# Altium project GD_Tcontroller.PrjPcb
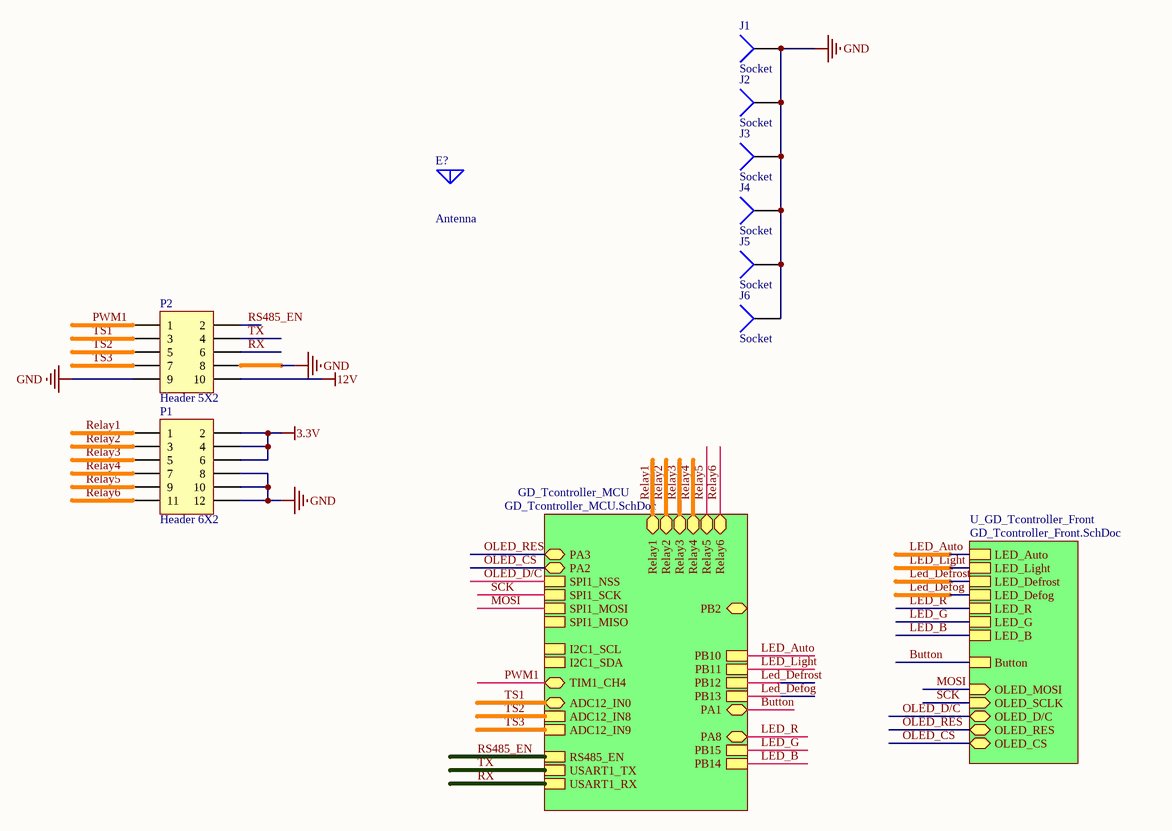
[diagram p0: GD_Tcontroller.SchDoc]
3 sheets, 61 parts. Net scope: hierarchical (ports join the sheet entries above them; power ports are global).
Board file: GD_Tcontroller.PcbDoc
Sheets:
  GD_Tcontroller.SchDoc
    GD_Tcontroller_MCU = GD_Tcontroller_MCU.SchDoc
    U_GD_Tcontroller_Front = GD_Tcontroller_Front.SchDoc

## Sheet GD_Tcontroller.SchDoc
size A4

### Parts
E?  Antenna  [OLED]
J1  Socket  [SCREWFG3_2]
J2  Socket  [SCREWFG3_2]
J3  Socket  [SCREWFG3_2]
J4  Socket  [SCREWFG3_2]
J5  Socket  [SCREWFG3_2]
J6  Socket  [SCREWFG3_2]
P1  Header 6X2  [DC3-12P]
P2  Header 5X2  [DC3-10P]

### Sub-sheets
GD_Tcontroller_MCU = GD_Tcontroller_MCU.SchDoc: USART1_TX, USART1_RX, SPI1_SCK, SPI1_MISO, SPI1_MOSI, SPI1_NSS, I2C1_SCL, I2C1_SDA, ADC12_IN8, ADC12_IN9, RS485_EN, PB10, PB11, PB12, PB13, PB14, PB15, PA2, PA3, PB2, Relay1, Relay5, Relay4, Relay3, Relay6, Relay2, TIM1_CH4, PA1, ADC12_IN0, PA8
U_GD_Tcontroller_Front = GD_Tcontroller_Front.SchDoc: LED_B, LED_G, LED_R, Button, LED_Auto, LED_Light, LED_Defrost, LED_Defog, OLED_MOSI (in), OLED_SCLK (in), OLED_D/C (bidir), OLED_RES (bidir), OLED_CS (bidir)

### Nets
3.3V: P1.2 P1.4 P1.6
12V: P2.10
GND: J1.1 J2.1 J3.1 J4.1 J5.1 J6.1 P1.8 P1.10 P1.12 P2.8 P2.9
Button: sheet GD_Tcontroller_MCU/PA1, sheet U_GD_Tcontroller_Front/Button
LED_Auto: sheet GD_Tcontroller_MCU/PB10, sheet U_GD_Tcontroller_Front/LED_Auto
LED_B: sheet GD_Tcontroller_MCU/PB14, sheet U_GD_Tcontroller_Front/LED_B
Led_Defog: sheet GD_Tcontroller_MCU/PB13, sheet U_GD_Tcontroller_Front/LED_Defog
Led_Defrost: sheet GD_Tcontroller_MCU/PB12, sheet U_GD_Tcontroller_Front/LED_Defrost
LED_G: sheet GD_Tcontroller_MCU/PB15, sheet U_GD_Tcontroller_Front/LED_G
LED_Light: sheet GD_Tcontroller_MCU/PB11, sheet U_GD_Tcontroller_Front/LED_Light
LED_R: sheet GD_Tcontroller_MCU/PA8, sheet U_GD_Tcontroller_Front/LED_R
MOSI: sheet GD_Tcontroller_MCU/SPI1_MOSI, sheet U_GD_Tcontroller_Front/OLED_MOSI
OLED_CS: sheet GD_Tcontroller_MCU/PA2, sheet U_GD_Tcontroller_Front/OLED_CS
OLED_D/C: sheet GD_Tcontroller_MCU/SPI1_NSS, sheet U_GD_Tcontroller_Front/OLED_D/C
OLED_RES: sheet GD_Tcontroller_MCU/PA3, sheet U_GD_Tcontroller_Front/OLED_RES
PWM1: P2.1 ; sheet GD_Tcontroller_MCU/TIM1_CH4
Relay1: P1.1 ; sheet GD_Tcontroller_MCU/Relay1
Relay2: P1.3 ; sheet GD_Tcontroller_MCU/Relay2
Relay3: P1.5 ; sheet GD_Tcontroller_MCU/Relay3
Relay4: P1.7 ; sheet GD_Tcontroller_MCU/Relay4
Relay5: P1.9 ; sheet GD_Tcontroller_MCU/Relay5
Relay6: P1.11 ; sheet GD_Tcontroller_MCU/Relay6
RS485_EN: P2.2 ; sheet GD_Tcontroller_MCU/RS485_EN
RX: P2.6 ; sheet GD_Tcontroller_MCU/USART1_RX
SCK: sheet GD_Tcontroller_MCU/SPI1_SCK, sheet U_GD_Tcontroller_Front/OLED_SCLK
TS1: P2.3 ; sheet GD_Tcontroller_MCU/ADC12_IN0
TS2: P2.5 ; sheet GD_Tcontroller_MCU/ADC12_IN8
TS3: P2.7 ; sheet GD_Tcontroller_MCU/ADC12_IN9
TX: P2.4 ; sheet GD_Tcontroller_MCU/USART1_TX

### Library data of the parts
E? = Antenna: Generic Antenna; Published: 24-Mar-1999; LatestRevisionDate: 17-Jul-2002; LatestRevisionNote: Re-released for DXP Platform.; PackageReference: PIN1; Publisher: Altium Limited
P1 = Header 6X2: Header, 6-Pin, Dual row; LatestRevisionDate: 17-Jul-2002; LatestRevisionNote: Re-released for DXP Platform.; Publisher: Altium Limited
P2 = Header 5X2: Header, 5-Pin, Dual row; LatestRevisionDate: 17-Jul-2002; LatestRevisionNote: Re-released for DXP Platform.; Publisher: Altium Limited
J1-J6 = Socket: LatestRevisionDate: 17-Jul-2002; LatestRevisionNote: Re-released for DXP Platform.; Publisher: Altium Limited

## Sheet GD_Tcontroller_MCU.SchDoc
size A4
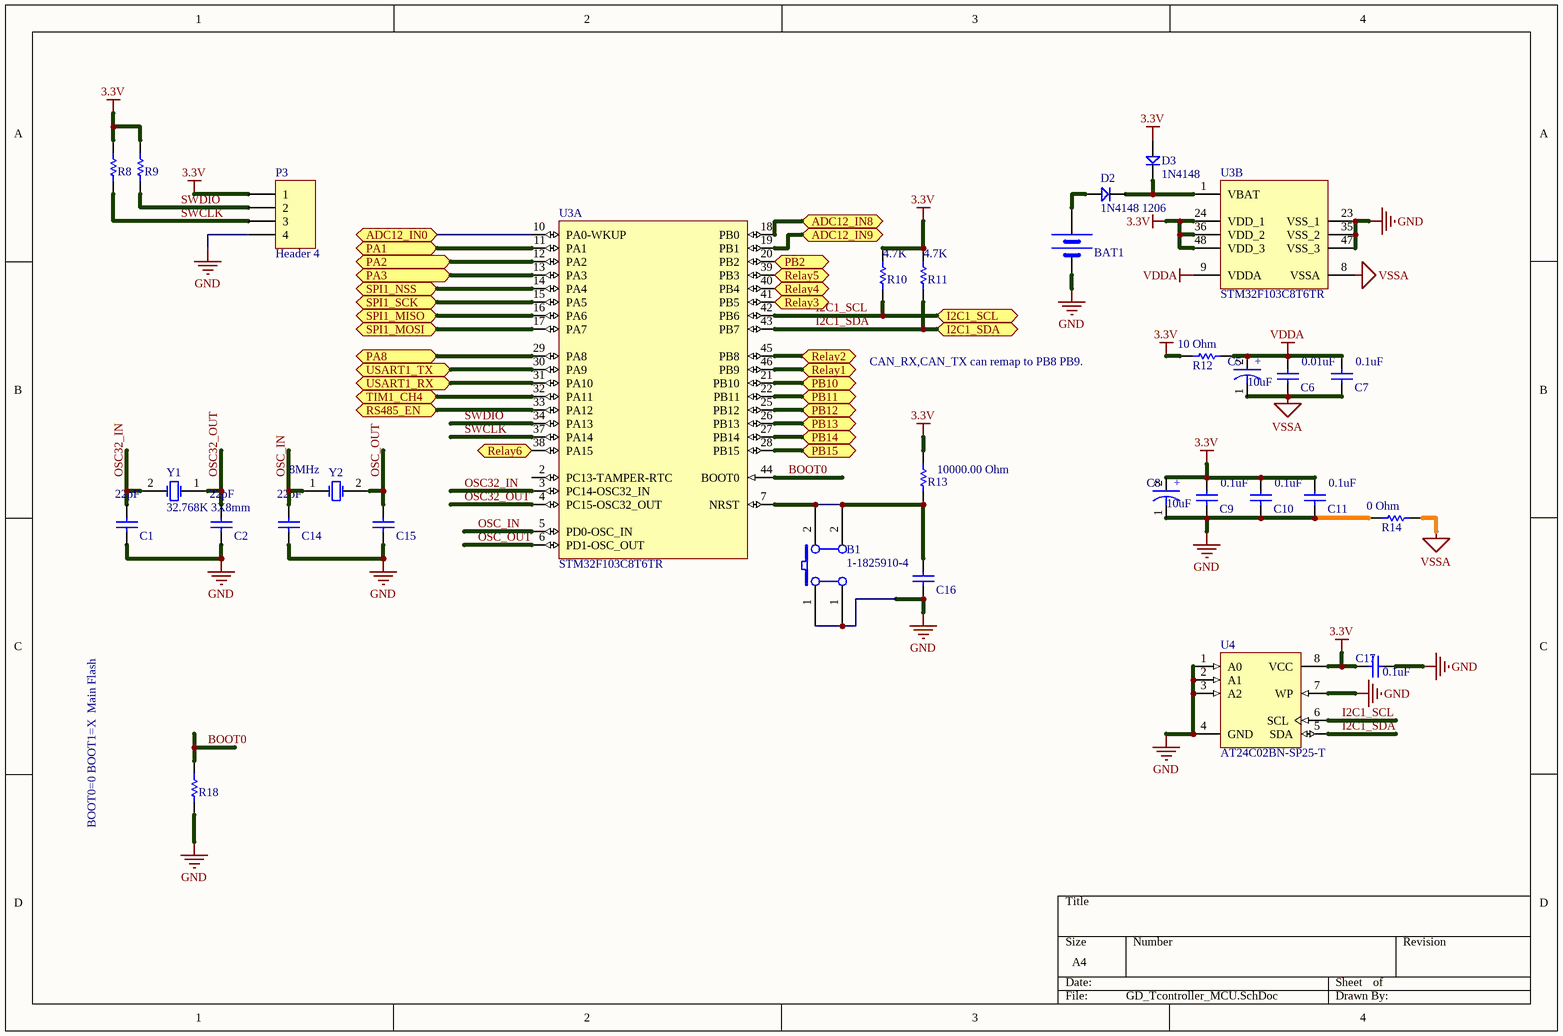
[diagram p1: GD_Tcontroller_MCU.SchDoc]

### Parts
B1  value 1-1825910-4  [AN6_3P6_5]  (hidden comment: SW PUSHBUTTON)
BAT1  CR1220 Sockect SMD  [BATM]  (value not drawn)
C1  value 22pF  [C0805]  (hidden comment: CAP 22pF 50V 0805(2012))
C2  value 22pF  [C0805]  (hidden comment: CAP 22pF 50V 0805(2012))
C5  value 10uF  [TAN3216]  (hidden comment: CAPACITOR)
C6  value 0.01uF  [C0805]  (hidden comment: CAP 0.01uF 50V 0805(2012))
C7  value 0.1uF  [C0805]  (hidden comment: CAP 0.1uF 50V 0805(2012))
C8  value 10uF  [TAN3216]  (hidden comment: CAPACITOR)
C9  value 0.1uF  [C0805]  (hidden comment: CAP 0.1uF 50V 0805(2012))
C10  value 0.1uF  [C0805]  (hidden comment: CAP 0.1uF 50V 0805(2012))
C11  value 0.1uF  [C0805]  (hidden comment: CAP 0.1uF 50V 0805(2012))
C14  value 22pF  [C0805]  (hidden comment: CAP 22pF 50V 0805(2012))
C15  CAP 22pF 50V 0805(2012)  [C0805]  (value not drawn)
C16  CAP 0.1uF 50V 0805(2012)  [C0805]  (value not drawn)
C17  value 0.1uF  [C0805]  (hidden comment: CAP 0.1uF 50V 0805(2012))
D2  1N4148 1206  [DIODE_SOP]
D3  1N4148  [DIODE_SOP]
P3  Header 4  [HDR1X4]
R8  10K 5% 0805(2012)  [R0805]  (value not drawn)
R9  10K 5% 0805(2012)  [R0805]  (value not drawn)
R10  value 4.7K  [R0805]  (hidden comment: 4.7K 5% 0805(2012))
R11  value 4.7K  [R0805]  (hidden comment: 4.7K 5% 0805(2012))
R12  value 10 Ohm  [R0805]  (hidden comment: 10Ohm 5% 0805(2012))
R13  value 10000.00 Ohm  [R0805]  (hidden comment: 10K 5% 0805(2012))
R14  value 0 Ohm  [R0805]  (hidden comment: 0 Ohm 5% 0805(2012))
R18  10K 5% 0805(2012)  [R0805]  (value not drawn)
U3  STM32F103C8T6TR  [STM-LQFP48_L]  (parts A,B of 2)
U4  AT24C02BN-SP25-T  [8S1_L]
Y1  32.768K 3X8mm  [XTAL32]
Y2  8MHz  [XTAL_US]

### Ports
ADC12_IN0, ADC12_IN8, ADC12_IN9, I2C1_SCL, I2C1_SDA, PA1, PA2, PA3, PA8, PB2, PB10, PB11, PB12, PB13, PB14, PB15, Relay1, Relay2, Relay3, Relay4, Relay5, Relay6, RS485_EN, SPI1_MISO, SPI1_MOSI, SPI1_NSS, SPI1_SCK, TIM1_CH4, USART1_RX, USART1_TX

### Nets
3.3V: C8.2 C9.2 C10.2 C11.2 C17.2 D3.1 P3.1 R8.1 R9.1 R10.1 R11.1 R12.1 R13.1 U3.24(VDD_1) U3.36(VDD_2) U3.48(VDD_3) U4.8(VCC)
GND: B1.1(A0) BAT1.2(GND) C1.1 C2.1 C8.1 C9.1 C10.1 C11.1 C14.1 C15.1 C16.1 C17.1 P3.4 R14.1 R18.2 U3.23(VSS_1) U3.35(VSS_2) U3.47(VSS_3) U4.1(A0) U4.2(A1) U4.3(A2) U4.4(GND) U4.7(WP)
VDDA: C5.2 C6.2 C7.2 R12.2 U3.9(VDDA)
VSSA: C5.1 C6.1 C7.1 R14.2 U3.8(VSSA)
BOOT0: R18.1 U3.44(BOOT0)
Button: U3.11(PA1) ; port PA1
I2C1_SCL: R10.2 U3.42(PB6) U4.6(SCL) ; port I2C1_SCL
I2C1_SDA: R11.2 U3.43(PB7) U4.5(SDA) ; port I2C1_SDA
LED_Auto: U3.21(PB10) ; port PB10
LED_B: U3.27(PB14) ; port PB14
Led_Defog: U3.26(PB13) ; port PB13
Led_Defrost: U3.25(PB12) ; port PB12
LED_G: U3.28(PB15) ; port PB15
LED_Light: U3.22(PB11) ; port PB11
LED_R: U3.29(PA8) ; port PA8
MOSI: U3.17(PA7) ; port SPI1_MOSI
OLED_CS: U3.12(PA2) ; port PA2
OLED_D/C: U3.14(PA4) ; port SPI1_NSS
OLED_RES: U3.13(PA3) ; port PA3
OSC32_IN: C1.2 U3.3(PC14-OSC32_IN) Y1.2(OSC2)
OSC32_OUT: C2.2 U3.4(PC15-OSC32_OUT) Y1.1(OSC1)
OSC_IN: C14.2 U3.5(PD0-OSC_IN) Y2.1(OSC1)
OSC_OUT: C15.2 U3.6(PD1-OSC_OUT) Y2.2(OSC2)
PWM1: U3.32(PA11) ; port TIM1_CH4
Relay1: U3.46(PB9) ; port Relay1
Relay2: U3.45(PB8) ; port Relay2
Relay3: U3.41(PB5) ; port Relay3
Relay4: U3.40(PB4) ; port Relay4
Relay5: U3.39(PB3) ; port Relay5
Relay6: U3.38(PA15) ; port Relay6
RS485_EN: U3.33(PA12) ; port RS485_EN
RX: U3.31(PA10) ; port USART1_RX
SCK: U3.15(PA5) ; port SPI1_SCK
SWCLK: P3.3 R8.2 U3.37(PA14)
SWDIO: P3.2 R9.2 U3.34(PA13)
TS1: U3.10(PA0-WKUP) ; port ADC12_IN0
TS2: U3.18(PB0) ; port ADC12_IN8
TS3: U3.19(PB1) ; port ADC12_IN9
TX: U3.30(PA9) ; port USART1_TX
NetB1_2: B1.2(B0) C16.2 R13.2 U3.7(NRST)
NetBAT1_1: BAT1.1(VCC) D2.1
NetD2_2: D2.2 D3.2 U3.1(VBAT)
NetU3_16: U3.16(PA6) ; port SPI1_MISO
NetU3_20: U3.20(PB2) ; port PB2

Not connected (* = marked no-connect by the designer): U3 2(PC13-TAMPER-RTC)

### Notes on the sheet
- CAN_RX,CAN_TX can remap to PB8 PB9.
- BOOT0=0 BOOT1=X  Main Flash
- (in symbol EC00035) +

### Library data of the parts
B1 = ES00003: Button ON/OFF，6.3X6.3X9.5MM,DIP-2; Manufacturer: Tyco Electronics; ID: 3; HelpURL: \\192.168.1.3\Esh\Department\RD\CAD\Component\button\ENG_CD_1825910_C6[1].pdf; P/N: ES00003; Manufacturer P/N: 1-1825910-4; Type: *****
BAT1 = BAT
C1 C2 C14 C15 = CMP-1036-01234-1: CAP 22pF 50V ±1% 0805 (2012 Metric) Thickness 0.75mm SMD; Case-EIA: 0805; Case-Metric: 2012; Rated Voltage: 50 V; Tolerance: ±1%; Technology: SMT; Max Thickness: 0.75 mm
  C15: Value: 22pF
C5 C8 = EC00035: TAN 10uF 20% 10V 3216; Manufacturer: AVX; Manufacturer P/N: TAJE106K050RNJ; ID: 35; Type: ****; HelpURL: \\192.168.1.3\Esh\Department\RD\CAD\Component\Capacitor\smd\AVX_tps.PDF; P/N: EC00035
C6 C7 C9-C11 C16 C17 = CMP-1036-00070-1: CAP 0.1uF 50V ±20% 0805 (2012 Metric) Thickness 1mm SMD; Case-Metric: 2012; Case-EIA: 0805; Tolerance: 20%; Rated Voltage: 50 V; Technology: SMT; Max Thickness: 1 mm
  C16: Value: 0.1uF
D2 = D: 1N4148
D3 = D
P3 = Header 4: Header, 4-Pin; LatestRevisionDate: 17-Jul-2002; LatestRevisionNote: Re-released for DXP Platform.; Publisher: Altium Limited
R8 R9 R18 = CMP-1013-00098-1: 10K 0.125W 5% 0805 (2012 Metric)  SMD; Case-EIA: 0805; Case-Metric: 2012; Value: 10000.00 Ohm; Power: 0.125 W; Technology: SMT; Tolerance: 5 %
R10 R11 = CMP-1013-00098-1: 4.7K 0.125W 5% 0805 (2012 Metric)  SMD; Case-EIA: 0805; Case-Metric: 2012; Power: 0.125 W; Technology: SMT; Tolerance: 5 %
R12 R14 = CMP-1013-00098-1: 10Ohm 0.125W 5% 0805 (2012 Metric)  SMD; Case-EIA: 0805; Case-Metric: 2012; Power: 0.125 W; Technology: SMT; Tolerance: 5 %
R13 = CMP-1013-00098-1: 10K 0.125W 5% 0805 (2012 Metric)  SMD; Case-EIA: 0805; Case-Metric: 2012; Power: 0.125 W; Technology: SMT; Tolerance: 5 %
U3 = CMP-0237-00216-3: ARM Cortex-M3 32-bit MCU, 64 KB Flash, 20 KB Internal RAM, 37 I/Os, 48-pin LQFP, -40 to 85 degC, Tape and Reel; A/D Converter: 2x12-bit (10 Channel); Internal RAM Size (kB): 20; Supply Voltage(Vcc) min (V): 2; I/Os (High Current): 37; FLASH Size (Prog) (kB): 64; Operating Frequency(F) (Processor speed) (MHz): 72; Packing: Tape and Reel; PackageReference: LQFP48; ComponentLink2Description: Datasheet; Core: ARM Cortex-M3; ComponentLink3URL: http://www.st.com/st-web-ui/static/active/en/resource/technical/document/datasheet/DM00058181.pdf; ComponentLink1Description: Manufacturer URL; ComponentLink3Description: Package Specification; PartNumber: STM32F103C8T6TR; PackageVersion: Rev. 6, 06/2013; ComponentLink2URL: http://www.st.com/st-web-ui/static/active/en/resource/technical/document/datasheet/CD00161566.pdf; PackageDescription: 48-Pin Low Profile Quad Flat Package, 7 x 7 mm Body, 0.5 mm Pitch; Mounting Technology: Surface Mount; DatasheetVersion: Rev. 16; ComponentLink1URL: http://www.st.com/web/en/home.html
U4 = CMP-0152-00023-1: 2Kbit (256 x 8), 2-wire Bus Automotive Serial EEPROM with full memory Write Protect, 2.5V, 8-Pin SOIC, Tape & Reel; PackageDescription: 8-Lead (0.150" Wide Body), Plastic Gull Wing Small Outline (JEDEC SOIC); Code_IPC: SOIC127P600-8; PackageReference: 8S1; DatasheetVersion: 8517C,  Jan-2009; Code_JEDEC: MS-012-AA; PackageVersion: revC, Mar-2005
Y1 = XTAL_1: 32.768K 3mmX8mm; Published: 8-Jun-2000; LatestRevisionDate: 17-Jul-2002; LatestRevisionNote: Re-released for DXP Platform.; Publisher: Altium Limited
Y2 = XTAL: Crystal Oscillator; Published: 8-Jun-2000; LatestRevisionDate: 17-Jul-2002; LatestRevisionNote: Re-released for DXP Platform.; Publisher: Altium Limited

## Sheet GD_Tcontroller_Front.SchDoc
size A4
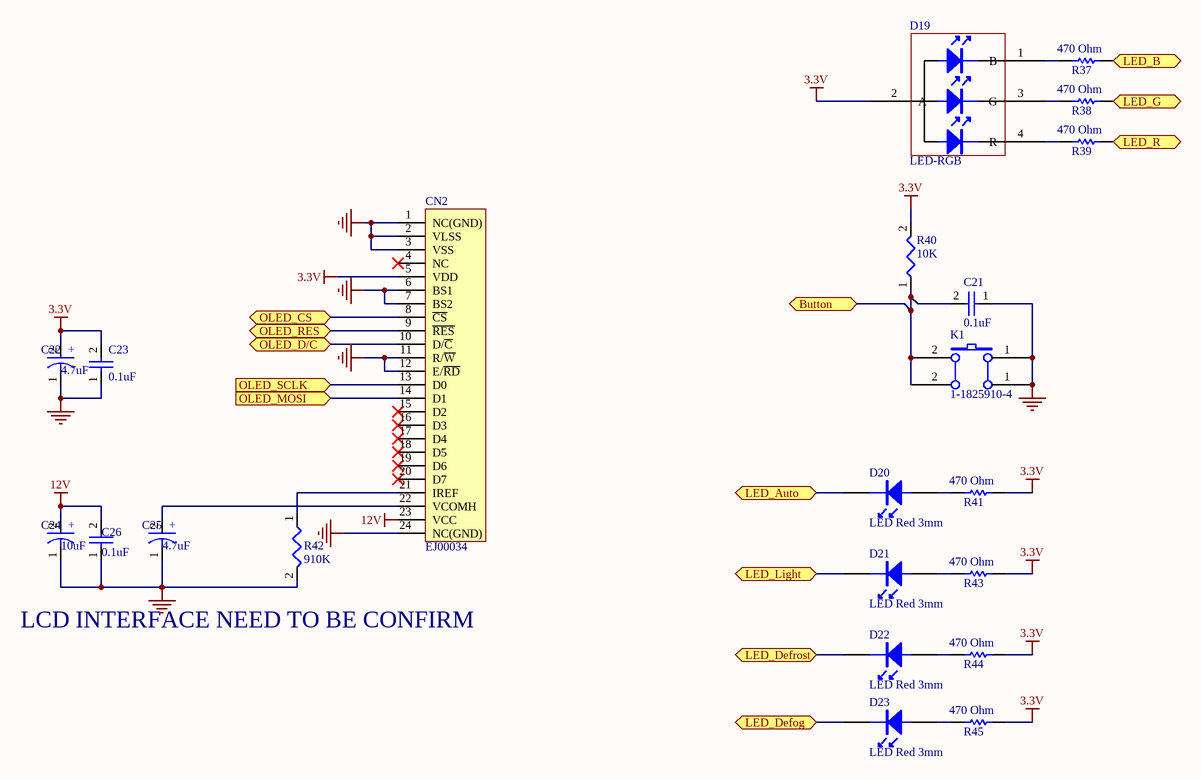
[diagram p2: GD_Tcontroller_Front.SchDoc]

### Parts
C21  value 0.1uF  [C0805]  (hidden comment: CAP)
C22  value 4.7uF  [TAN3216]  (hidden comment: CAPACITOR)
C23  value 0.1uF  [C0805]  (hidden comment: CAP)
C24  value 10uF  [TAN6032]  (hidden comment: CAPACITOR)
C25  value 4.7uF  [TAN6032]  (hidden comment: CAPACITOR)
C26  value 0.1uF  [C0805]  (hidden comment: CAP)
CN2  EJ00034  [FPC24P0_5]
D19  LED-RGB  [LED-RGB-3528]
D20  LED Red 3mm  [LED_DIP]
D21  LED Red 3mm  [LED_DIP]
D22  LED Red 3mm  [LED_DIP]
D23  LED Red 3mm  [LED_DIP]
K1  value 1-1825910-4  [AN6_3P6_5]  (hidden comment: SW PUSHBUTTON)
R37  value 470 Ohm  [R0805]  (hidden comment: 470 Ohm 5% 0805)
R38  value 470 Ohm  [R0805]  (hidden comment: 470 Ohm 5% 0805)
R39  value 470 Ohm  [R0805]  (hidden comment: 470 Ohm 5% 0805)
R40  value 10K  [R0805]  (hidden comment: RES)
R41  value 470 Ohm  [R0805]  (hidden comment: 470 Ohm 5% 0805)
R42  value 910K  [R0805]  (hidden comment: RES)
R43  value 470 Ohm  [R0805]  (hidden comment: 470 Ohm 5% 0805)
R44  value 470 Ohm  [R0805]  (hidden comment: 470 Ohm 5% 0805)
R45  value 470 Ohm  [R0805]  (hidden comment: 470 Ohm 5% 0805)

### Ports
Button, LED_Auto, LED_B, LED_Defog, LED_Defrost, LED_G, LED_Light, LED_R, OLED_CS (bidir), OLED_D/C (bidir), OLED_MOSI (in), OLED_RES (bidir), OLED_SCLK (in)

### Nets
3.3V: C22.2 C23.2 CN2.5(VDD) D19.2(A) R40.2 R41.2 R43.2 R44.2 R45.2
12V: C24.2 C26.2 CN2.23(VCC)
GND: C21.1 C22.1 C23.1 C24.1 C25.1 C26.1 CN2.1(NC(GND)) CN2.2(VLSS) CN2.3(VSS) CN2.6(BS1) CN2.7(BS2) CN2.11(R/~{W}) CN2.12(E/~{RD}) CN2.24(NC(GND)) K1.1(A0) R42.2
Button: C21.2 K1.2(B0) R40.1 ; port Button
LED_Auto: D20.2 ; port LED_Auto
LED_B: R37.2 ; port LED_B
Led_Defog: D23.2 ; port LED_Defog
Led_Defrost: D22.2 ; port LED_Defrost
LED_G: R38.2 ; port LED_G
LED_Light: D21.2 ; port LED_Light
LED_R: R39.2 ; port LED_R
MOSI: CN2.14(D1) ; port OLED_MOSI
OLED_CS: CN2.8(~{CS}) ; port OLED_CS
OLED_D/C: CN2.10(D/~{C}) ; port OLED_D/C
OLED_RES: CN2.9(~{RES}) ; port OLED_RES
SCK: CN2.13(D0) ; port OLED_SCLK
NetC25_2: C25.2 CN2.22(VCOMH)
NetCN2_21: CN2.21(IREF) R42.1
NetD19_1: D19.1(B) R37.1
NetD19_3: D19.3(G) R38.1
NetD19_4: D19.4(R) R39.1
NetD20_1: D20.1 R41.1
NetD21_1: D21.1 R43.1
NetD22_1: D22.1 R44.1
NetD23_1: D23.1 R45.1

Not connected (* = marked no-connect by the designer): CN2 4(NC)* 15(D2)* 16(D3)* 17(D4)* 18(D5)* 19(D6)* 20(D7)*

### Notes on the sheet
- LCD INTERFACE NEED TO BE CONFIRM
- (in symbol EC00035) +
- (in symbol EC00040) +

### Library data of the parts
C21 C23 C26 = EC00014: CAP SMD CR X7R 50V 10% 0.1uF 0805 ROHS; Manufacturer: YAGEO; Manufacturer P/N: CC0805KRX7R9BB104; ID: 14; HelpURL: *; P/N: EC00014
C22 = EC00035: as C5 on sheet GD_Tcontroller_MCU; HelpURL: \\192.168.1.3\Esh\Department\RD\CAD\Component\Capacitor\smd\AVX_tps.PDF; P/N: EC00035
C24 = EC00035: CAP SMD Tan 35V 10% 10uF 2917 ROHS; Manufacturer: AVX; Manufacturer P/N: TAJE106K050RNJ; ID: 35; Type: ****; HelpURL: \\192.168.1.3\Esh\Department\RD\CAD\Component\Capacitor\smd\AVX_tps.PDF; P/N: EC00035
C25 = EC00040: CAP SMD Tan 35V 10% 4.7uF 2312 ROHS; Manufacturer: AVX; Manufacturer P/N: TPSC475K035#0600; ID: 40; Type: ****; HelpURL: \\192.168.1.3\Esh\Department\RD\CAD\Component\Capacitor\smd\AVX_tps.PDF; P/N: EC00040
CN2 = EJ00034: CONNECTOR FPC0.5MM 24PIN,0.4A,50V,SMT; Manufacturer P/N: SFV24R-1STE1HLF; Manufacturer: FCI; ID: 34; Value: SFV24R-1STE1HLF; HelpURL: \\192.168.1.3\Esh\Department\RD\CAD\Component\connector\FPC\SFV24R-2STE1HLF.pdf; P/N: EJ00034; Type: *****
D20-D23 = LED
K1 = ES00003: as B1 on sheet GD_Tcontroller_MCU; HelpURL: \\192.168.1.3\Esh\Department\RD\CAD\Component\button\ENG_CD_1825910_C6[1].pdf; P/N: ES00003; Manufacturer P/N: 1-1825910-4; Type: *****
R37-R39 R41 R43-R45 = CMP-1013-00098-1: 470Ohm 0.125W 5% 0805 (2012 Metric)  SMD; Case-EIA: 0805; Case-Metric: 2012; Power: 0.125 W; Technology: SMT; Tolerance: 5 %
R40 = ER00031: RES THICK_FILM SMD 10K 5% 1/8W ROHS 0805; Manufacturer: YAGEO; Manufacturer P/N: RC0805JR-0710KL; ID: 31; HelpURL: *; P/N: ER00031
R42 = ER00075: RES 	THICK_FILM SMD 910K 1%	 1/8W 	ROHS 	0805; Manufacturer: YAGEO; Manufacturer P/N: RC0805FR-07910KL; ID: 75; HelpURL: *; P/N: ER00075

## Nets that join several sheets
3.3V: GD_Tcontroller (P1.2 P1.4 P1.6), GD_Tcontroller_MCU (17 pins), GD_Tcontroller_Front (9 pins)
12V: GD_Tcontroller (P2.10), GD_Tcontroller_Front (C24.2 C26.2 CN2.23)
GND: GD_Tcontroller (11 pins), GD_Tcontroller_MCU (23 pins), GD_Tcontroller_Front (16 pins)
Button: GD_Tcontroller_MCU (U3.11), GD_Tcontroller_Front (C21.2 K1.2 R40.1)
LED_Auto: GD_Tcontroller_MCU (U3.21), GD_Tcontroller_Front (D20.2)
LED_B: GD_Tcontroller_MCU (U3.27), GD_Tcontroller_Front (R37.2)
Led_Defog: GD_Tcontroller_MCU (U3.26), GD_Tcontroller_Front (D23.2)
Led_Defrost: GD_Tcontroller_MCU (U3.25), GD_Tcontroller_Front (D22.2)
LED_G: GD_Tcontroller_MCU (U3.28), GD_Tcontroller_Front (R38.2)
LED_Light: GD_Tcontroller_MCU (U3.22), GD_Tcontroller_Front (D21.2)
LED_R: GD_Tcontroller_MCU (U3.29), GD_Tcontroller_Front (R39.2)
MOSI: GD_Tcontroller_MCU (U3.17), GD_Tcontroller_Front (CN2.14)
OLED_CS: GD_Tcontroller_MCU (U3.12), GD_Tcontroller_Front (CN2.8)
OLED_D/C: GD_Tcontroller_MCU (U3.14), GD_Tcontroller_Front (CN2.10)
OLED_RES: GD_Tcontroller_MCU (U3.13), GD_Tcontroller_Front (CN2.9)
PWM1: GD_Tcontroller (P2.1), GD_Tcontroller_MCU (U3.32)
Relay1: GD_Tcontroller (P1.1), GD_Tcontroller_MCU (U3.46)
Relay2: GD_Tcontroller (P1.3), GD_Tcontroller_MCU (U3.45)
Relay3: GD_Tcontroller (P1.5), GD_Tcontroller_MCU (U3.41)
Relay4: GD_Tcontroller (P1.7), GD_Tcontroller_MCU (U3.40)
Relay5: GD_Tcontroller (P1.9), GD_Tcontroller_MCU (U3.39)
Relay6: GD_Tcontroller (P1.11), GD_Tcontroller_MCU (U3.38)
RS485_EN: GD_Tcontroller (P2.2), GD_Tcontroller_MCU (U3.33)
RX: GD_Tcontroller (P2.6), GD_Tcontroller_MCU (U3.31)
SCK: GD_Tcontroller_MCU (U3.15), GD_Tcontroller_Front (CN2.13)
TS1: GD_Tcontroller (P2.3), GD_Tcontroller_MCU (U3.10)
TS2: GD_Tcontroller (P2.5), GD_Tcontroller_MCU (U3.18)
TS3: GD_Tcontroller (P2.7), GD_Tcontroller_MCU (U3.19)
TX: GD_Tcontroller (P2.4), GD_Tcontroller_MCU (U3.30)